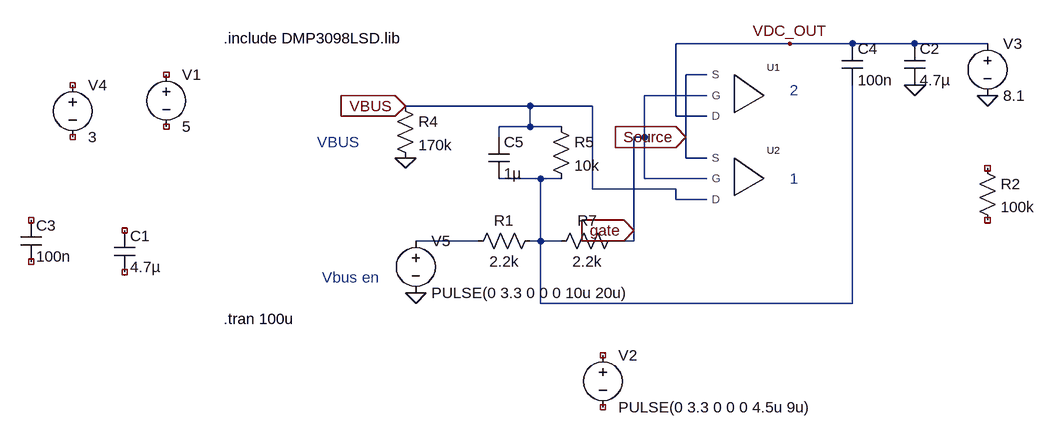
[diagram p0: schematic PMOS_Load_switch_backtoback_sim.asc]
PMOS_Load_switch_backtoback_sim.asc, the LTspice schematic file:
Version 4.1
SHEET 1 1000 680
WIRE 512 -112 336 -112
WIRE 608 -112 512 -112
WIRE 704 -112 608 -112
WIRE 816 -112 704 -112
WIRE 384 -64 352 -64
WIRE 384 -32 288 -32
WIRE 112 -16 -80 -16
WIRE 208 -16 112 -16
WIRE 336 0 336 -112
WIRE 384 0 336 0
WIRE 112 16 112 -16
WIRE 112 16 64 16
WIRE 160 16 112 16
WIRE 64 32 64 16
WIRE 288 32 288 -32
WIRE 288 32 272 32
WIRE 352 32 352 -64
WIRE 352 64 352 32
WIRE 384 64 352 64
WIRE 128 96 64 96
WIRE 160 96 128 96
WIRE 288 96 288 32
WIRE 384 96 288 96
WIRE 208 112 208 -16
WIRE 336 112 208 112
WIRE 336 128 336 112
WIRE 384 128 336 128
WIRE 272 176 272 32
WIRE 32 192 -64 192
WIRE 128 192 128 96
WIRE 128 192 112 192
WIRE 160 192 128 192
WIRE 272 192 272 176
WIRE 272 192 240 192
WIRE 128 288 128 192
WIRE 608 288 608 -48
WIRE 608 288 128 288
FLAG 816 -32 0
FLAG 704 -48 0
FLAG 272 176 gate
IOPIN 272 176 In
FLAG 512 -112 VDC_OUT
FLAG -80 -16 VBUS
IOPIN -80 -16 In
FLAG -80 64 0
FLAG -64 272 0
FLAG 352 32 Source
IOPIN 352 32 In
SYMBOL voltage -448 -80 R0
WINDOW 123 0 0 Left 0
WINDOW 39 0 0 Left 0
SYMATTR InstName V1
SYMATTR Value 5
SYMBOL voltage 224 352 R0
WINDOW 123 0 0 Left 0
WINDOW 39 0 0 Left 0
SYMATTR InstName V2
SYMATTR Value PULSE(0 3.3 0 0 0 4.5u 9u)
SYMBOL cap -528 176 R0
SYMATTR InstName C1
SYMATTR Value 4.7µ
SYMBOL DMP3098LSD 352 -48 R0
SYMATTR InstName U1
SYMBOL DMP3098LSD 352 80 R0
SYMATTR InstName U2
SYMBOL cap 688 -112 R0
SYMATTR InstName C2
SYMATTR Value 4.7µ
SYMBOL cap -672 160 R0
SYMATTR InstName C3
SYMATTR Value 100n
SYMBOL voltage 816 -128 R0
WINDOW 123 0 0 Left 0
WINDOW 39 0 0 Left 0
SYMATTR InstName V3
SYMATTR Value 8.1
SYMBOL res 800 64 R0
SYMATTR InstName R2
SYMATTR Value 100k
SYMBOL voltage -592 -64 R0
WINDOW 123 0 0 Left 0
WINDOW 39 0 0 Left 0
SYMATTR InstName V4
SYMATTR Value 3
SYMBOL res -96 -32 R0
SYMATTR InstName R4
SYMATTR Value 170k
SYMBOL cap 48 32 R0
SYMATTR InstName C5
SYMATTR Value 1µ
SYMBOL res 144 0 R0
SYMATTR InstName R5
SYMATTR Value 10k
SYMBOL res 256 176 R90
WINDOW 0 0 56 VBottom 2
WINDOW 3 32 56 VTop 2
SYMATTR InstName R7
SYMATTR Value 2.2k
SYMBOL res 128 176 R90
WINDOW 0 0 56 VBottom 2
WINDOW 3 32 56 VTop 2
SYMATTR InstName R1
SYMATTR Value 2.2k
SYMBOL voltage -64 176 R0
WINDOW 123 0 0 Left 0
WINDOW 39 0 0 Left 0
SYMATTR InstName V5
SYMATTR Value PULSE(0 3.3 0 0 0 10u 20u)
SYMBOL cap 592 -112 R0
SYMATTR InstName C4
SYMATTR Value 100n
TEXT -360 -120 Left 2 !.include DMP3098LSD.lib
TEXT -208 248 Left 2 ;Vbus en
TEXT 512 96 Left 2 ;1
TEXT 512 -40 Left 2 ;2
TEXT -360 312 Left 2 !.tran 100u
TEXT -216 40 Left 2 ;VBUS

The netlist it stands for:
* PMOS_Load_switch_backtoback_sim.asc
V1 NC_01 NC_02 5
V2 NC_03 NC_04 PULSE(0 3.3 0 0 0 4.5u 9u)
C1 NC_05 NC_06 4.7µ
X§U1 VDC_OUT gate Source DMP3098LSD  ; pins D G S
X§U2 VBUS gate Source DMP3098LSD  ; pins D G S
C2 VDC_OUT 0 4.7µ
C3 NC_07 NC_08 100n
V3 VDC_OUT 0 8.1
R2 NC_09 NC_10 100k
V4 NC_11 NC_12 3
R4 VBUS 0 170k
C5 VBUS N001 1µ
R5 VBUS N001 10k
R7 gate N001 2.2k
R1 N001 N002 2.2k
V5 N002 0 PULSE(0 3.3 0 0 0 10u 20u)
C4 VDC_OUT N001 100n
.include DMP3098LSD.lib
* Vbus en
* 1
* 2
.tran 100u
* VBUS
.backanno
.end